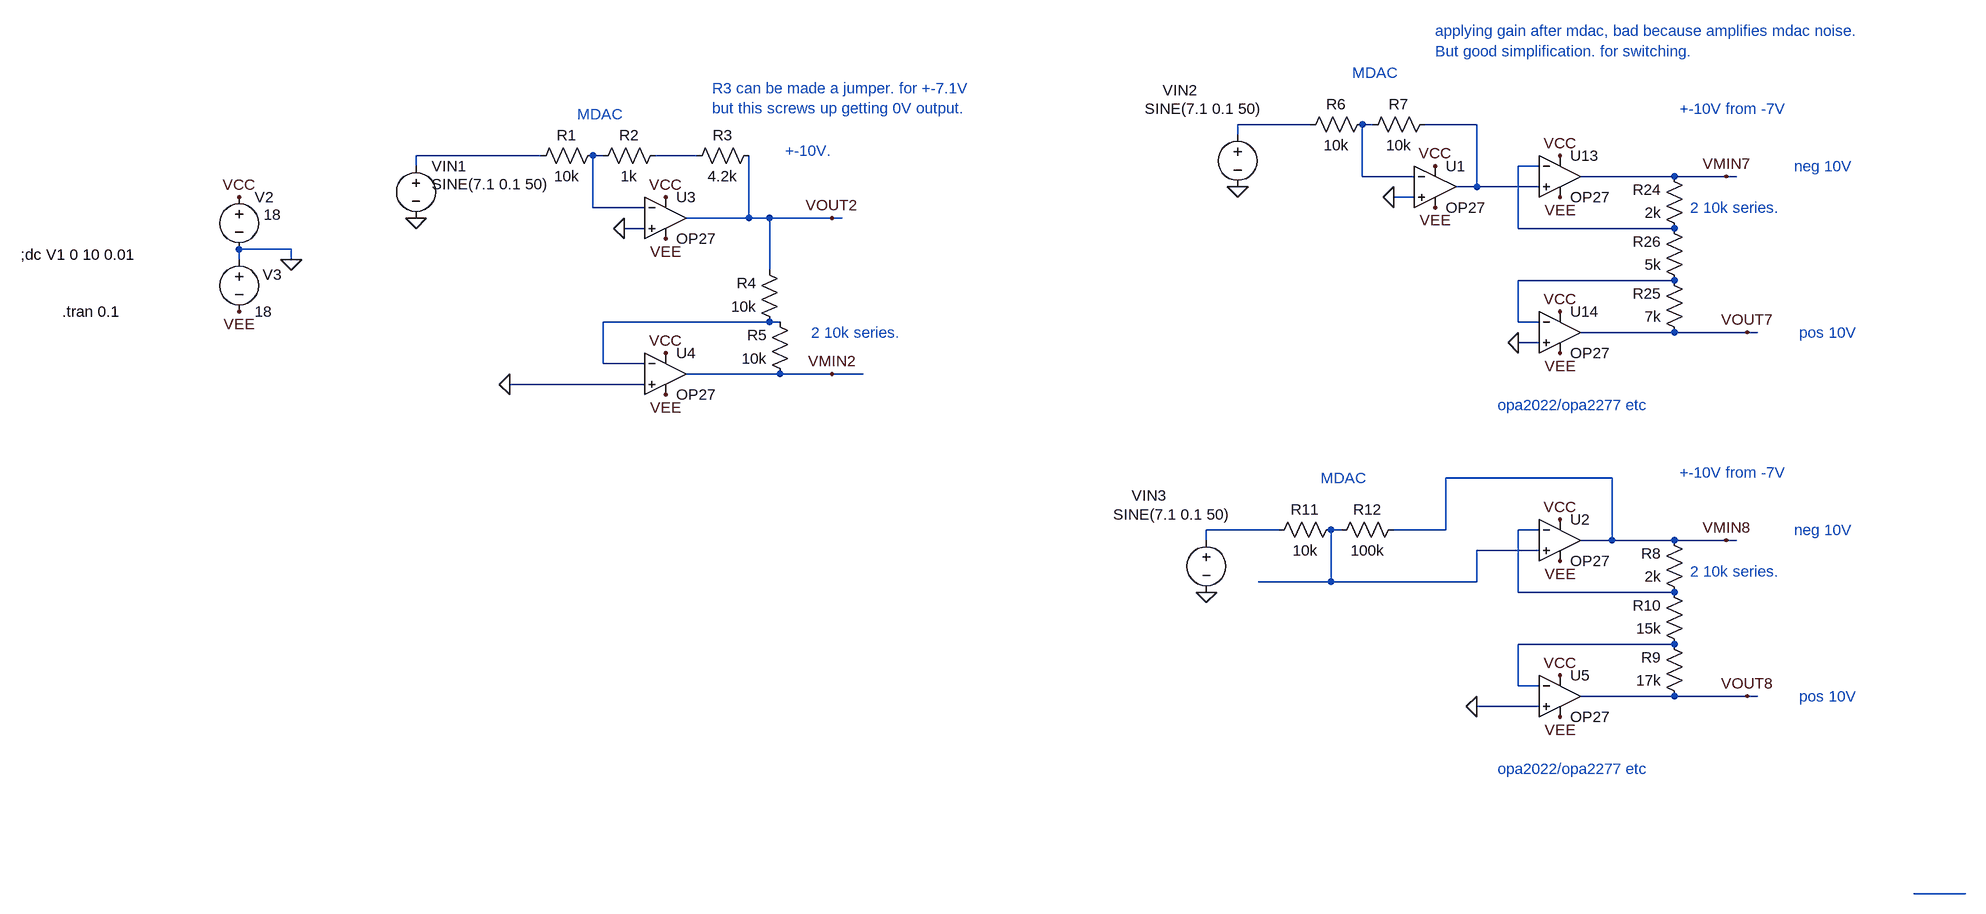
[diagram p0: schematic Draft23.asc]
Draft23.asc, the LTspice schematic file:
Version 4
SHEET 1 3336 1280
WIRE 1504 -160 1392 -160
WIRE 1600 -160 1584 -160
WIRE 1760 -160 1680 -160
WIRE 1392 -144 1392 -160
WIRE 320 -112 128 -112
WIRE 416 -112 400 -112
WIRE 560 -112 496 -112
WIRE 128 -96 128 -112
WIRE 1856 -96 1824 -96
WIRE 1584 -80 1584 -160
WIRE 1664 -80 1584 -80
WIRE 2064 -80 1920 -80
WIRE 2144 -80 2064 -80
WIRE 2160 -80 2144 -80
WIRE 1760 -64 1760 -160
WIRE 1760 -64 1728 -64
WIRE 1856 -64 1760 -64
WIRE 1664 -48 1632 -48
WIRE 400 -32 400 -112
WIRE 480 -32 400 -32
WIRE 640 -16 640 -112
WIRE 640 -16 544 -16
WIRE 672 -16 640 -16
WIRE 768 -16 672 -16
WIRE 784 -16 768 -16
WIRE 480 0 448 0
WIRE 1824 0 1824 -96
WIRE 2064 0 1824 0
WIRE -64 32 -144 32
WIRE -144 48 -144 32
WIRE -64 48 -64 32
WIRE 672 64 672 -16
WIRE 2064 80 1824 80
WIRE 672 144 416 144
WIRE 688 144 672 144
WIRE 1824 144 1824 80
WIRE 1856 144 1824 144
WIRE 2064 160 1920 160
WIRE 2176 160 2064 160
WIRE 2192 160 2176 160
WIRE 1856 176 1824 176
WIRE 416 208 416 144
WIRE 480 208 416 208
WIRE 688 224 544 224
WIRE 768 224 688 224
WIRE 816 224 768 224
WIRE 480 240 272 240
WIRE 1968 384 1712 384
WIRE 1456 464 1344 464
WIRE 1552 464 1536 464
WIRE 1712 464 1712 384
WIRE 1712 464 1632 464
WIRE 1856 464 1824 464
WIRE 1344 480 1344 464
WIRE 1968 480 1968 384
WIRE 1968 480 1920 480
WIRE 2064 480 1968 480
WIRE 2144 480 2064 480
WIRE 2160 480 2144 480
WIRE 1856 496 1760 496
WIRE 1536 544 1536 464
WIRE 1536 544 1424 544
WIRE 1760 544 1760 496
WIRE 1760 544 1536 544
WIRE 1824 560 1824 464
WIRE 2064 560 1824 560
WIRE 2064 640 1824 640
WIRE 1824 704 1824 640
WIRE 1856 704 1824 704
WIRE 2064 720 1920 720
WIRE 2176 720 2064 720
WIRE 2192 720 2176 720
WIRE 1856 736 1760 736
WIRE 2512 1024 2432 1024
FLAG -64 48 0
FLAG -144 -48 VCC
FLAG -144 128 VEE
FLAG 128 -16 0
FLAG 768 -16 VOUT2
FLAG 512 -48 VCC
FLAG 512 16 VEE
FLAG 512 192 VCC
FLAG 512 256 VEE
FLAG 768 224 VMIN2
FLAG 448 0 0
FLAG 2176 160 VOUT7
FLAG 1888 -112 VCC
FLAG 1888 -48 VEE
FLAG 1888 128 VCC
FLAG 1888 192 VEE
FLAG 2144 -80 VMIN7
FLAG 1824 176 0
FLAG 272 240 0
FLAG 1392 -64 0
FLAG 1696 -96 VCC
FLAG 1696 -32 VEE
FLAG 1632 -48 0
FLAG 2176 720 VOUT8
FLAG 1888 448 VCC
FLAG 1888 512 VEE
FLAG 1888 688 VCC
FLAG 1888 752 VEE
FLAG 2144 480 VMIN8
FLAG 1344 560 0
FLAG 1760 736 0
SYMBOL voltage -144 -64 R0
WINDOW 123 0 0 Left 0
WINDOW 39 0 0 Left 0
WINDOW 3 38 43 Left 2
SYMATTR Value 18
SYMATTR InstName V2
SYMBOL voltage -144 32 R0
WINDOW 123 0 0 Left 0
WINDOW 39 0 0 Left 0
WINDOW 0 36 39 Left 2
SYMATTR InstName V3
SYMATTR Value 18
SYMBOL voltage 128 -112 R0
WINDOW 123 0 0 Left 0
WINDOW 39 0 0 Left 0
WINDOW 3 24 44 Left 2
SYMATTR Value SINE(7.1 0.1 50)
SYMATTR InstName VIN1
SYMBOL res 688 160 R180
WINDOW 0 36 76 Left 2
WINDOW 3 36 40 Left 2
SYMATTR InstName R4
SYMATTR Value 10k
SYMBOL res 704 240 R180
WINDOW 0 36 76 Left 2
WINDOW 3 36 40 Left 2
SYMATTR InstName R5
SYMATTR Value 10k
SYMBOL OpAmps\\OP27 512 -80 R0
SYMATTR InstName U3
SYMBOL OpAmps\\OP27 512 160 R0
SYMATTR InstName U4
SYMBOL res 2080 16 R180
WINDOW 0 36 76 Left 2
WINDOW 3 36 40 Left 2
SYMATTR InstName R24
SYMATTR Value 2k
SYMBOL res 2080 176 R180
WINDOW 0 36 76 Left 2
WINDOW 3 36 40 Left 2
SYMATTR InstName R25
SYMATTR Value 7k
SYMBOL OpAmps\\OP27 1888 -144 R0
SYMATTR InstName U13
SYMBOL OpAmps\\OP27 1888 96 R0
SYMATTR InstName U14
SYMBOL res 2080 96 R180
WINDOW 0 36 76 Left 2
WINDOW 3 36 40 Left 2
SYMATTR InstName R26
SYMATTR Value 5k
SYMBOL res 416 -128 R90
WINDOW 0 0 56 VBottom 2
WINDOW 3 32 56 VTop 2
SYMATTR InstName R1
SYMATTR Value 10k
SYMBOL res 512 -128 R90
WINDOW 0 0 56 VBottom 2
WINDOW 3 32 56 VTop 2
SYMATTR InstName R2
SYMATTR Value 1k
SYMBOL res 656 -128 R90
WINDOW 0 0 56 VBottom 2
WINDOW 3 32 56 VTop 2
SYMATTR InstName R3
SYMATTR Value 4.2k
SYMBOL voltage 1392 -160 R0
WINDOW 123 0 0 Left 0
WINDOW 39 0 0 Left 0
WINDOW 3 -143 -24 Left 2
WINDOW 0 -115 -53 Left 2
SYMATTR Value SINE(7.1 0.1 50)
SYMATTR InstName VIN2
SYMBOL OpAmps\\OP27 1696 -128 R0
SYMATTR InstName U1
SYMBOL res 1600 -176 R90
WINDOW 0 0 56 VBottom 2
WINDOW 3 32 56 VTop 2
SYMATTR InstName R6
SYMATTR Value 10k
SYMBOL res 1696 -176 R90
WINDOW 0 0 56 VBottom 2
WINDOW 3 32 56 VTop 2
SYMATTR InstName R7
SYMATTR Value 10k
SYMBOL res 2080 576 R180
WINDOW 0 36 76 Left 2
WINDOW 3 36 40 Left 2
SYMATTR InstName R8
SYMATTR Value 2k
SYMBOL res 2080 736 R180
WINDOW 0 36 76 Left 2
WINDOW 3 36 40 Left 2
SYMATTR InstName R9
SYMATTR Value 17k
SYMBOL OpAmps\\OP27 1888 416 R0
SYMATTR InstName U2
SYMBOL OpAmps\\OP27 1888 656 R0
SYMATTR InstName U5
SYMBOL res 2080 656 R180
WINDOW 0 36 76 Left 2
WINDOW 3 36 40 Left 2
SYMATTR InstName R10
SYMATTR Value 15k
SYMBOL voltage 1344 464 R0
WINDOW 123 0 0 Left 0
WINDOW 39 0 0 Left 0
WINDOW 3 -143 -24 Left 2
WINDOW 0 -115 -53 Left 2
SYMATTR Value SINE(7.1 0.1 50)
SYMATTR InstName VIN3
SYMBOL res 1552 448 R90
WINDOW 0 0 56 VBottom 2
WINDOW 3 32 56 VTop 2
SYMATTR InstName R11
SYMATTR Value 10k
SYMBOL res 1648 448 R90
WINDOW 0 0 56 VBottom 2
WINDOW 3 32 56 VTop 2
SYMATTR InstName R12
SYMATTR Value 100k
TEXT -480 40 Left 2 !;dc V1 0 10 0.01
TEXT -416 128 Left 2 !.tran 0.1
TEXT 696 -120 Left 2 ;+-10V.
TEXT 736 160 Left 2 ;2 10k series.
TEXT 2072 -184 Left 2 ;+-10V from -7V
TEXT 2088 -32 Left 2 ;2 10k series.
TEXT 2256 160 Left 2 ;pos 10V
TEXT 2248 -96 Left 2 ;neg 10V
TEXT 584 -216 Left 2 ;R3 can be made a jumper. for +-7.1V\nbut this screws up getting 0V output.
TEXT 1568 -240 Left 2 ;MDAC
TEXT 1696 -304 Left 2 ;applying gain after mdac, bad because amplifies mdac noise.\nBut good simplification. for switching.
TEXT 376 -176 Left 2 ;MDAC
TEXT 1792 272 Left 2 ;opa2022/opa2277 etc
TEXT 2072 376 Left 2 ;+-10V from -7V
TEXT 2088 528 Left 2 ;2 10k series.
TEXT 2256 720 Left 2 ;pos 10V
TEXT 2248 464 Left 2 ;neg 10V
TEXT 1792 832 Left 2 ;opa2022/opa2277 etc
TEXT 1520 384 Left 2 ;MDAC

The netlist it stands for:
* Draft23.asc
V2 VCC 0 18
V3 0 VEE 18
VIN1 N004 0 SINE(7.1 0.1 50)
R4 N009 VOUT2 10k
R5 VMIN2 N009 10k
XU3 0 N005 VCC VEE VOUT2 OP27  ; pins In+ In- V+ V- OUT
XU4 0 N009 VCC VEE VMIN2 OP27  ; pins In+ In- V+ V- OUT
R24 N007 VMIN7 2k
R25 VOUT7 N008 7k
XU13 N003 N007 VCC VEE VMIN7 OP27  ; pins In+ In- V+ V- OUT
XU14 0 N008 VCC VEE VOUT7 OP27  ; pins In+ In- V+ V- OUT
R26 N008 N007 5k
R1 N005 N004 10k
R2 N006 N005 1k
R3 VOUT2 N006 4.2k
VIN2 N001 0 SINE(7.1 0.1 50)
XU1 0 N002 VCC VEE N003 OP27  ; pins In+ In- V+ V- OUT
R6 N002 N001 10k
R7 N003 N002 10k
R8 N012 VMIN8 2k
R9 VOUT8 N013 17k
XU2 N011 N012 VCC VEE VMIN8 OP27  ; pins In+ In- V+ V- OUT
XU5 0 N013 VCC VEE VOUT8 OP27  ; pins In+ In- V+ V- OUT
R10 N013 N012 15k
VIN3 N010 0 SINE(7.1 0.1 50)
R11 N011 N010 10k
R12 VMIN8 N011 100k
;dc V1 0 10 0.01
.tran 0.1
* +-10V.
* 2 10k series.
* +-10V from -7V
* 2 10k series.
* pos 10V
* neg 10V
* R3 can be made a jumper. for +-7.1V
* but this screws up getting 0V output.
* MDAC
* applying gain after mdac, bad because amplifies mdac noise.
* But good simplification. for switching.
* MDAC
* opa2022/opa2277 etc
* +-10V from -7V
* 2 10k series.
* pos 10V
* neg 10V
* opa2022/opa2277 etc
* MDAC
.lib ADI.lib
.backanno
.end